# Altium schematic sheet Digital_IN.SchDoc: Digital inputs
size A3; Organization: ORGANIZATION; Address1: ADDRESS 1; Address2: ADDRESS 2; Address3: ADDRESS 3; Address4: ADDRESS 4; Revision: 0.0; SheetNumber: 9; SheetTotal: 19; ENG_APP_DATE: --/--/--; DSN_APP_DATE: --/--/--; CHK_APP_DATE: --/--/--
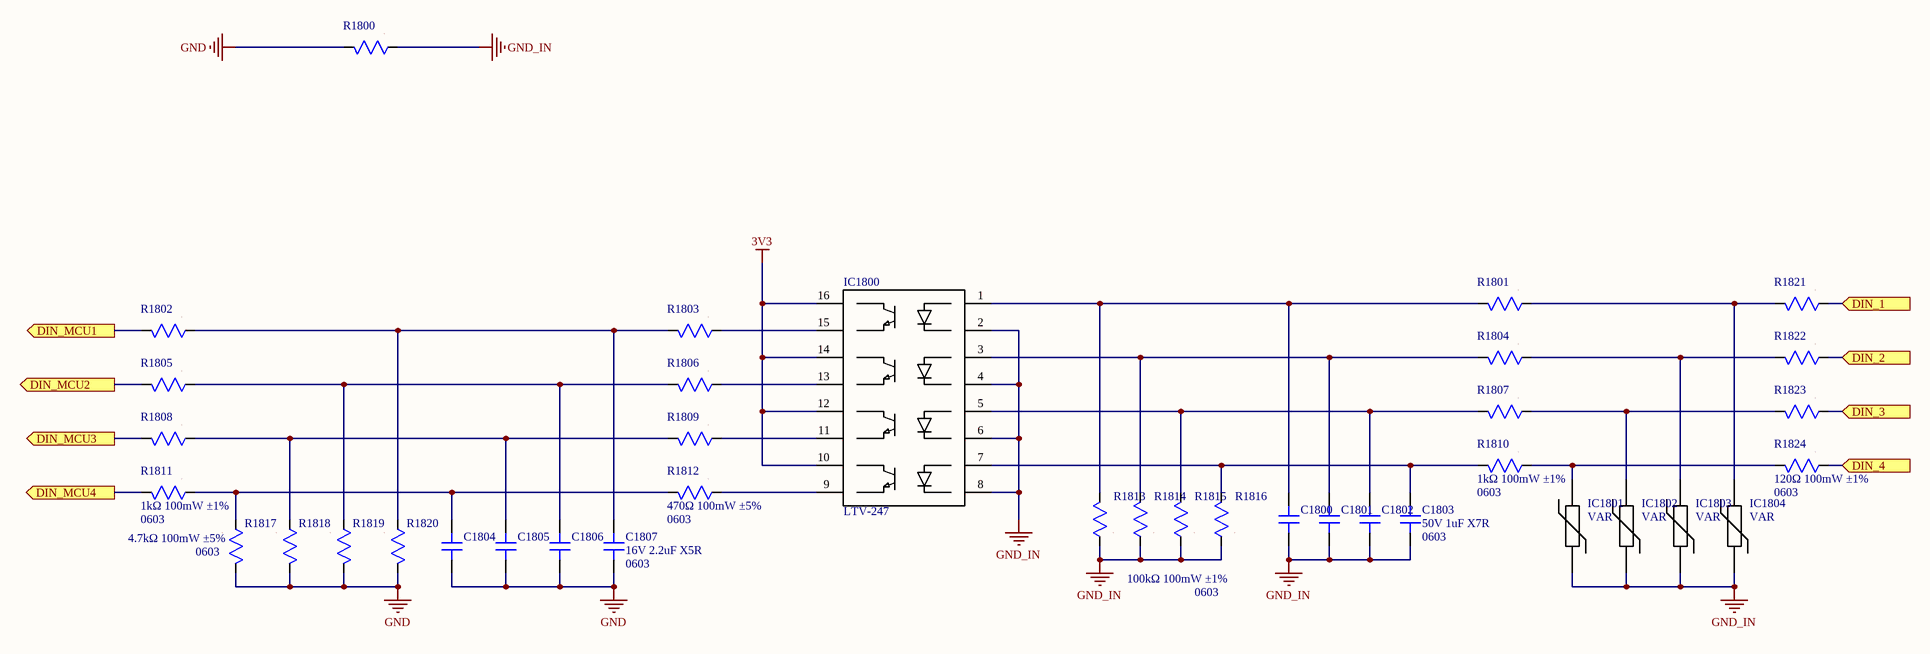
[diagram p0: Digital_IN.SchDoc]

## Parts
C1800  CAP non polarized  [CAP SMD 0603]  (value not drawn)
C1801  CAP non polarized  [CAP SMD 0603]  (value not drawn)
C1802  CAP non polarized  [CAP SMD 0603]  (value not drawn)
C1803  value 50V 1uF X7R  Package: 0603  [CAP SMD 0603]  (hidden comment: CAP non polarized)
C1804  CAP non polarized  [CAP SMD 0603]  (value not drawn)
C1805  CAP non polarized  [CAP SMD 0603]  (value not drawn)
C1806  CAP non polarized  [CAP SMD 0603]  (value not drawn)
C1807  value 16V 2.2uF X5R  Package: 0603  [CAP SMD 0603]  (hidden comment: CAP non polarized)
IC1800  LTV-247  [SOP-16]
IC1801  VAR  [VAR SMD 0805]
IC1802  VAR  [VAR SMD 0805]
IC1803  VAR  [VAR SMD 0805]
IC1804  VAR  [VAR SMD 0805]
R1800  RES  [RES SMD 0603]  (value not drawn)
R1801  RES  [RES SMD 0603]  (value not drawn)
R1802  RES  [RES SMD 0603]  (value not drawn)
R1803  RES  [RES SMD 0603]  (value not drawn)
R1804  RES  [RES SMD 0603]  (value not drawn)
R1805  RES  [RES SMD 0603]  (value not drawn)
R1806  RES  [RES SMD 0603]  (value not drawn)
R1807  RES  [RES SMD 0603]  (value not drawn)
R1808  RES  [RES SMD 0603]  (value not drawn)
R1809  RES  [RES SMD 0603]  (value not drawn)
R1810  value 1kΩ 100mW ±1%  Package: 0603  [RES SMD 0603]  (hidden comment: RES)
R1811  value 1kΩ 100mW ±1%  Package: 0603  [RES SMD 0603]  (hidden comment: RES)
R1812  value 470Ω 100mW ±5%  Package: 0603  [RES SMD 0603]  (hidden comment: RES)
R1813  value 100kΩ 100mW ±1%  Package: 0603  [RES SMD 0603]  (hidden comment: RES)
R1814  RES  [RES SMD 0603]  (value not drawn)
R1815  RES  [RES SMD 0603]  (value not drawn)
R1816  RES  [RES SMD 0603]  (value not drawn)
R1817  value 4.7kΩ 100mW ±5%  Package: 0603  [RES SMD 0603]  (hidden comment: RES)
R1818  RES  [RES SMD 0603]  (value not drawn)
R1819  RES  [RES SMD 0603]  (value not drawn)
R1820  RES  [RES SMD 0603]  (value not drawn)
R1821  RES  [RES SMD 0603]  (value not drawn)
R1822  RES  [RES SMD 0603]  (value not drawn)
R1823  RES  [RES SMD 0603]  (value not drawn)
R1824  value 120Ω 100mW ±1%  Package: 0603  [RES SMD 0603]  (hidden comment: RES)

## Ports
DIN_1 (in), DIN_2 (in), DIN_3 (in), DIN_4 (in), DIN_MCU1 (out), DIN_MCU2 (out), DIN_MCU3 (out), DIN_MCU4 (out)

## Nets
3V3: IC1800.10(C_4) IC1800.12(C_3) IC1800.14(C_2) IC1800.16(C_1)
GND: C1804.2 C1805.2 C1806.2 C1807.2 R1800.2 R1817.2 R1818.2 R1819.2 R1820.2
GND_IN: C1800.2 C1801.2 C1802.2 C1803.2 IC1800.2(K_1) IC1800.4(K_2) IC1800.6(K_3) IC1800.8(K_4) IC1801.1 IC1802.1 IC1803.1 IC1804.1 R1800.1 R1813.1 R1814.1 R1815.1 R1816.1
DIN_1: R1821.1 ; port DIN_1
DIN_2: R1822.1 ; port DIN_2
DIN_3: R1823.1 ; port DIN_3
DIN_4: R1824.1 ; port DIN_4
DIN_MCU1: R1802.2 ; port DIN_MCU1
DIN_MCU2: R1805.2 ; port DIN_MCU2
DIN_MCU3: R1808.2 ; port DIN_MCU3
DIN_MCU4: R1811.2 ; port DIN_MCU4
NetC1800_1: C1800.1 IC1800.1(A_1) R1801.2 R1813.2
NetC1801_1: C1801.1 IC1800.3(A_2) R1804.2 R1814.2
NetC1802_1: C1802.1 IC1800.5(A_3) R1807.2 R1815.2
NetC1803_1: C1803.1 IC1800.7(A_4) R1810.2 R1816.2
NetC1804_1: C1804.1 R1811.1 R1812.2 R1817.1
NetC1805_1: C1805.1 R1808.1 R1809.2 R1818.1
NetC1806_1: C1806.1 R1805.1 R1806.2 R1819.1
NetC1807_1: C1807.1 R1802.1 R1803.2 R1820.1
NetIC1800_9: IC1800.9(E_4) R1812.1
NetIC1800_11: IC1800.11(E_3) R1809.1
NetIC1800_13: IC1800.13(E_2) R1806.1
NetIC1800_15: IC1800.15(E_1) R1803.1
NetIC1801_2: IC1801.2 R1810.1 R1824.2
NetIC1802_2: IC1802.2 R1807.1 R1823.2
NetIC1803_2: IC1803.2 R1804.1 R1822.2
NetIC1804_2: IC1804.2 R1801.1 R1821.2

## Notes on the sheet
- Project:
- Subsystem:
- Company:
- Document:
- Author:
- Revision:
- Date:
- Sheet:
- /

## Library data of the parts
C1800-C1802 = 001-0102: Condensadores de cerámica multicapa (MLCC- SMD/SMT) WCAP-CSGP 1uF 50 Vol 10%; MPN: 885012206126; Manufacturer: Wurth Elektronik; Value: 50V 1uF X7R; ComponentLink1Description: Datasheet; ComponentLink1URL: https://www.we-online.com/components/products/datasheet/885012206126.pdf; ComponentLink2Description: Distributor Link; ComponentLink2URL: https://www.mouser.es/ProductDetail/Wurth-Elektronik/885012206126?qs=amGC7iS6iy%2F%252BJOLb%2FSuwig%3D%3D; Package: 0603; ID: 001-0102; Distributor PN: 710-885012206126; Distributor: Mouser
C1803 = 001-0102: Condensadores de cerámica multicapa (MLCC- SMD/SMT) WCAP-CSGP 1uF 50 Vol 10%; MPN: 885012206126; Manufacturer: Wurth Elektronik; ComponentLink1Description: Datasheet; ComponentLink1URL: https://www.we-online.com/components/products/datasheet/885012206126.pdf; ComponentLink2Description: Distributor Link; ComponentLink2URL: https://www.mouser.es/ProductDetail/Wurth-Elektronik/885012206126?qs=amGC7iS6iy%2F%252BJOLb%2FSuwig%3D%3D; ID: 001-0102; Distributor PN: 710-885012206126; Distributor: Mouser
C1804-C1806 = 001-0113: Condensadores de cerámica multicapa (MLCC- SMD/SMT) WCAP-CSGP 2.2uF 16V 10%; MPN: 885012106029; Manufacturer: Wurth Elektronik; Value: 16V 2.2uF X5R; ComponentLink1Description: Datasheet; ComponentLink1URL: https://www.we-online.com/components/products/datasheet/885012106029.pdf; ComponentLink2Description: Distributor Link; ComponentLink2URL: https://www.mouser.es/ProductDetail/Wurth-Elektronik/885012106029?qs=amGC7iS6iy%252BgG3I4L92Nqg%3D%3D; Package: 0603; ID: 001-0113; Distributor PN: 710-885012106029; Distributor: Mouser
C1807 = 001-0113: Condensadores de cerámica multicapa (MLCC- SMD/SMT) WCAP-CSGP 2.2uF 16V 10%; MPN: 885012106029; Manufacturer: Wurth Elektronik; ComponentLink1Description: Datasheet; ComponentLink1URL: https://www.we-online.com/components/products/datasheet/885012106029.pdf; ComponentLink2Description: Distributor Link; ComponentLink2URL: https://www.mouser.es/ProductDetail/Wurth-Elektronik/885012106029?qs=amGC7iS6iy%252BgG3I4L92Nqg%3D%3D; ID: 001-0113; Distributor PN: 710-885012106029; Distributor: Mouser
IC1800 = 041-0002: Optoacopladores para salidas de transistores PTR 50% 5KV 16 PIN 4CH Optocoupler; Manufacturer: LITEON; ComponentLink1Description: Datasheet; ComponentLink1URL: https://www.mouser.com/catalog/specsheets/Lite-On-07-31-2018-LTV-2X7%20sereis%20Apr18.pdf?_gl=1*hv8h7o*_gcl_aw*R0NMLjE3ODA5NDM2MTUuQ2owS0NRancwSm5SQmhESkFSSXNBTG9iblhiTVZmV3NWb0pqSGVpNWRkTXk2SzRuNEhwRGVRWXYxa0dMT0s1N0VWSjRWQlE1eFhBYUoxd2FBa3NuRUFMd193Y0I.*_gcl_au*MjAyMjI4MzgwOS4xNzc1NDk0ODAwLjEzNjA3ODI2NzguMTc4MzExMDAxNi4xNzgzMTEwMDE2*_ga*Nzg3Njk5NTY0LjE3NDY2Mzg0MjI.*_ga_15W4STQT4T*czE3ODMxMTAwMTYkbzEzNyRnMSR0MTc4MzExMDAxOSRqNTckbDAkaDA.; ComponentLink2Description: Distributor Link; ComponentLink2URL: https://www.mouser.es/ProductDetail/LITEON/LTV-247?qs=9ayhpukWNmvWpoxQBzWkFA%3D%3D; ID: 041-0002; Value: -; Package: SOP-16; MPN: LTV-247; Distributor PN: 859-LTV-247; Distributor: Mouser
IC1801-IC1804 = 036-0002: Varistores 18 VDC .3J 44V-CL 120A PK; MPN: V18MLA0805NH; Manufacturer: Littlefuse; Value: 18V 120A 520pF; ComponentLink1Description: Datasheet; ComponentLink1URL: https://www.littelfuse.com/assetdocs/littelfuse_varistor_mla_datasheet.pdf?assetguid=7092c93f-7453-48dd-8345-d10368b54a20; ComponentLink2Description: Distributor Link; ComponentLink2URL: https://www.mouser.es/es/ProductDetail/Littelfuse/V18MLA0805NH?qs=slssyL07VvNBxGr5IH4W1g%3D%3D; ID: 036-0002; Package: 0805; Distributor PN: 576-V18MLA0805NH; Distributor: Mouser
R1800 = 010-0160: Resistores de película gruesa - SMD WRIS-RSKS <0.05 Ohms 0.1 W Jumper 0603 AEC-Q200; MPN: 560112116001; Manufacturer: Wurth Elektronik; Value: 0Ω 100mW ±1%; ComponentLink1Description: Datasheet; ComponentLink1URL: https://www.we-online.com/components/products/datasheet/560112116001.pdf; ComponentLink2Description: Distributor Link; ComponentLink2URL: https://www.mouser.es/ProductDetail/Wurth-Elektronik/560112116001?qs=mELouGlnn3dlnHYj7TecuA%3D%3D; Package: 0603; ID: 010-0160; Distributor PN: 710-560112116001; Distributor: Mouser
R1801 R1802 R1804 R1805 R1807 R1808 = 010-0170: Thick Film Resistors WRIS-RSKS 1 kOhms 1 % 0.1 W 0603 AEC-Q200; MPN: 560112116014; Manufacturer: Wurth Elektronik; Value: 1kΩ 100mW ±1%; ComponentLink1Description: Datasheet; ComponentLink1URL: https://www.we-online.com/components/products/datasheet/560112116014.pdf; ComponentLink2Description: Distributor Link; ComponentLink2URL: https://www.mouser.es/ProductDetail/Wurth-Elektronik/560112116014?qs=sGAEpiMZZMvdGkrng054txLI%2FDB4oIKD92viHLDiYpSVemZawWv4yQ%3D%3D; Package: 0603; ID: 010-0170; Distributor PN: 710-560112116014; Distributor: Mouser
R1803 R1806 R1809 = 010-0187: Thick Film Resistors WRIS-RSKS 470 Ohms 5 % 0.1 W 0603 AEC-Q200; MPN: 560112116031; Manufacturer: Wurth Elektronik; Value: 470Ω 100mW ±5%; ComponentLink1Description: Datasheet; ComponentLink1URL: https://www.we-online.com/components/products/datasheet/560112116031.pdf; ComponentLink2Description: Distributor Link; ComponentLink2URL: https://www.mouser.es/ProductDetail/Wurth-Elektronik/560112116031?qs=sGAEpiMZZMvdGkrng054t2cqbZCzJY7Nc63jNcSJ2mNzAJgQFdfNBw%3D%3D; Package: 0603; ID: 010-0187; Distributor PN: 710-560112116031; Distributor: Mouser
R1810 R1811 = 010-0170: Thick Film Resistors WRIS-RSKS 1 kOhms 1 % 0.1 W 0603 AEC-Q200; MPN: 560112116014; Manufacturer: Wurth Elektronik; ComponentLink1Description: Datasheet; ComponentLink1URL: https://www.we-online.com/components/products/datasheet/560112116014.pdf; ComponentLink2Description: Distributor Link; ComponentLink2URL: https://www.mouser.es/ProductDetail/Wurth-Elektronik/560112116014?qs=sGAEpiMZZMvdGkrng054txLI%2FDB4oIKD92viHLDiYpSVemZawWv4yQ%3D%3D; ID: 010-0170; Distributor PN: 710-560112116014; Distributor: Mouser
R1812 = 010-0187: Thick Film Resistors WRIS-RSKS 470 Ohms 5 % 0.1 W 0603 AEC-Q200; MPN: 560112116031; Manufacturer: Wurth Elektronik; ComponentLink1Description: Datasheet; ComponentLink1URL: https://www.we-online.com/components/products/datasheet/560112116031.pdf; ComponentLink2Description: Distributor Link; ComponentLink2URL: https://www.mouser.es/ProductDetail/Wurth-Elektronik/560112116031?qs=sGAEpiMZZMvdGkrng054t2cqbZCzJY7Nc63jNcSJ2mNzAJgQFdfNBw%3D%3D; ID: 010-0187; Distributor PN: 710-560112116031; Distributor: Mouser
R1813 = 010-0190: Thick Film Resistors WRIS-RSKS 100 kOhms 1 % 0.1 W 0603 AEC-Q200; MPN: 560112116004; Manufacturer: Wurth Elektronik; ComponentLink1Description: Datasheet; ComponentLink1URL: https://www.we-online.com/components/products/datasheet/560112116004.pdf; ComponentLink2Description: Distributor Link; ComponentLink2URL: https://www.mouser.es/ProductDetail/Wurth-Elektronik/560112116004?qs=sGAEpiMZZMvdGkrng054txLI%2FDB4oIKDB%252BmfBE1ySSGuQklCN21gzA%3D%3D; ID: 010-0190; Distributor PN: 710-560112116004; Distributor: Mouser
R1814-R1816 = 010-0190: Thick Film Resistors WRIS-RSKS 100 kOhms 1 % 0.1 W 0603 AEC-Q200; MPN: 560112116004; Manufacturer: Wurth Elektronik; Value: 100kΩ 100mW ±1%; ComponentLink1Description: Datasheet; ComponentLink1URL: https://www.we-online.com/components/products/datasheet/560112116004.pdf; ComponentLink2Description: Distributor Link; ComponentLink2URL: https://www.mouser.es/ProductDetail/Wurth-Elektronik/560112116004?qs=sGAEpiMZZMvdGkrng054txLI%2FDB4oIKDB%252BmfBE1ySSGuQklCN21gzA%3D%3D; Package: 0603; ID: 010-0190; Distributor PN: 710-560112116004; Distributor: Mouser
R1817 = 010-0188: Thick Film Resistors WRIS-RSKS 4.7 kOhms 5 % 0.1 W 0402 AEC-Q200; MPN: 560112110018; Manufacturer: Wurth Elektronik; ComponentLink1Description: Datasheet; ComponentLink1URL: https://www.we-online.com/components/products/datasheet/560112110018.pdf; ComponentLink2Description: Distributor Link; ComponentLink2URL: https://www.mouser.es/ProductDetail/Wurth-Elektronik/560112110018?qs=sGAEpiMZZMvdGkrng054txLI%2FDB4oIKDXtogfAbE0Wc%252BspLjErwG3g%3D%3D; ID: 010-0188; Distributor PN: 710-560112110018; Distributor: Mouser
R1818-R1820 = 010-0188: Thick Film Resistors WRIS-RSKS 4.7 kOhms 5 % 0.1 W 0402 AEC-Q200; MPN: 560112110018; Manufacturer: Wurth Elektronik; Value: 4.7kΩ 100mW ±5%; ComponentLink1Description: Datasheet; ComponentLink1URL: https://www.we-online.com/components/products/datasheet/560112110018.pdf; ComponentLink2Description: Distributor Link; ComponentLink2URL: https://www.mouser.es/ProductDetail/Wurth-Elektronik/560112110018?qs=sGAEpiMZZMvdGkrng054txLI%2FDB4oIKDXtogfAbE0Wc%252BspLjErwG3g%3D%3D; Package: 0603; ID: 010-0188; Distributor PN: 710-560112110018; Distributor: Mouser
R1821-R1823 = 010-0177: Resistores de película gruesa - SMD WRIS-RSKS 120 Ohms 1 % 0.1 W 0603 AEC-Q200; MPN: 560112116119; Manufacturer: Wurth Elektronik; Value: 120Ω 100mW ±1%; ComponentLink1Description: Datasheet; ComponentLink1URL: https://www.we-online.com/components/products/datasheet/560112116119.pdf; ComponentLink2Description: Distributor Link; ComponentLink2URL: https://www.mouser.es/ProductDetail/Wurth-Elektronik/560112116119?qs=mELouGlnn3eT%2F22oIMY8Ng%3D%3D; Package: 0603; ID: 010-0177; Distributor PN: 710-560112116119; Distributor: Mouser
R1824 = 010-0177: Resistores de película gruesa - SMD WRIS-RSKS 120 Ohms 1 % 0.1 W 0603 AEC-Q200; MPN: 560112116119; Manufacturer: Wurth Elektronik; ComponentLink1Description: Datasheet; ComponentLink1URL: https://www.we-online.com/components/products/datasheet/560112116119.pdf; ComponentLink2Description: Distributor Link; ComponentLink2URL: https://www.mouser.es/ProductDetail/Wurth-Elektronik/560112116119?qs=mELouGlnn3eT%2F22oIMY8Ng%3D%3D; ID: 010-0177; Distributor PN: 710-560112116119; Distributor: Mouser